# Altium schematic sheet EPS_MPPT_Y.SchDoc: MPPT-Y
size A3; SheetNumber: 17; SheetTotal: 51
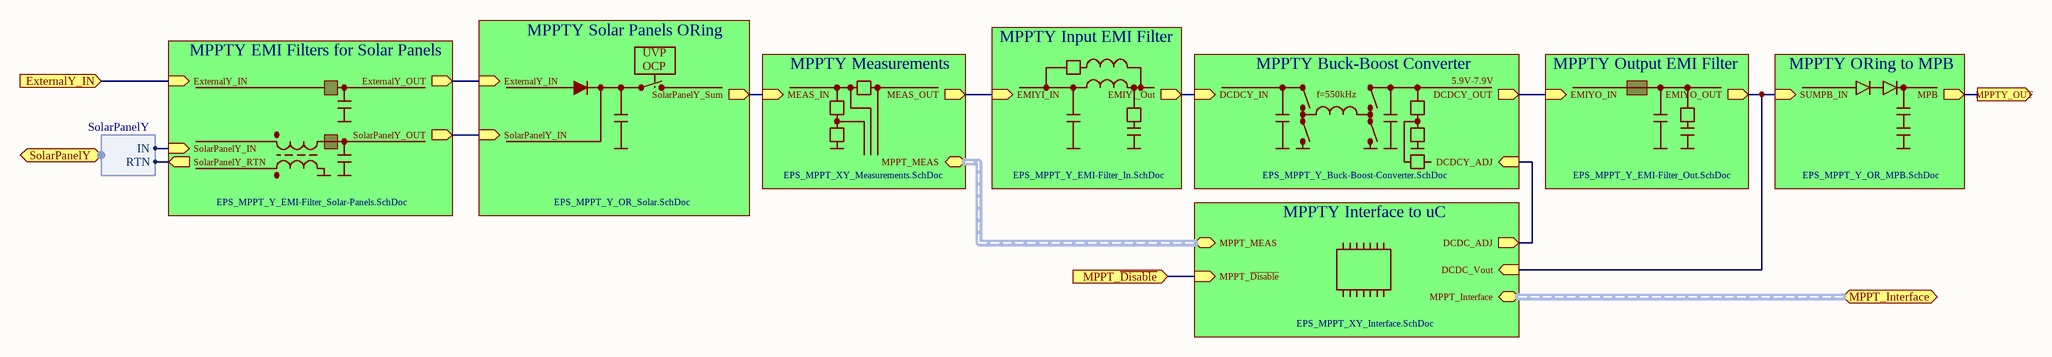
[diagram p0: EPS_MPPT_Y.SchDoc]

## Sub-sheets
MPPTY Buck-Boost Converter = EPS_MPPT_Y_Buck-Boost-Converter.SchDoc: DCDCY_IN (in), DCDCY_OUT (out), DCDCY_ADJ (in)
MPPTY EMI Filters for Solar Panels = EPS_MPPT_Y_EMI-Filter_Solar-Panels.SchDoc: SolarPanelY_IN (in), ExternalY_IN (in), SolarPanelY_RTN (out), ExternalY_OUT (out), SolarPanelY_OUT (out)
MPPTY Input EMI Filter = EPS_MPPT_Y_EMI-Filter_In.SchDoc: EMIYI_Out (out), EMIYI_IN (in)
MPPTY Interface to uC = EPS_MPPT_XY_Interface.SchDoc: DCDC_ADJ (out), MPPT_Interface (harness MPPT_Interface), MPPT_MEAS (harness MPPT_MEAS), DCDC_Vout (in), MPPT_~{Disable} (in)
MPPTY Measurements = EPS_MPPT_XY_Measurements.SchDoc: MEAS_IN (in), MEAS_OUT (out), MPPT_MEAS (harness MPPT_MEAS)
MPPTY ORing to MPB = EPS_MPPT_Y_OR_MPB.SchDoc: SUMPB_IN (in), MPB (out)
MPPTY Output EMI Filter = EPS_MPPT_Y_EMI-Filter_Out.SchDoc: EMIYO_IN (in), EMIYO_OUT (out)
MPPTY Solar Panels ORing = EPS_MPPT_Y_OR_Solar.SchDoc: ExternalY_IN (in), SolarPanelY_IN (in), SolarPanelY_Sum (out)

## Ports
ExternalY_IN (in), MPPT_Interface (harness MPPT_Interface), MPPT_~{Disable} (in), MPPTY_OUT (out), SolarPanelY (harness SolarPanelY)

## Harnesses
SolarPanelY: IN, RTN

## Nets
ExternalY_IN: port ExternalY_IN, sheet MPPTY EMI Filters for Solar Panels/ExternalY_IN
MPPT_~{Disable}: port MPPT_~{Disable}, sheet MPPTY Interface to uC/MPPT_~{Disable}
MPPTY_OUT: port MPPTY_OUT, sheet MPPTY ORing to MPB/MPB
(unnamed): sheet MPPTY Buck-Boost Converter/DCDCY_IN, sheet MPPTY Input EMI Filter/EMIYI_Out
(unnamed): sheet MPPTY Buck-Boost Converter/DCDCY_OUT, sheet MPPTY Output EMI Filter/EMIYO_IN
(unnamed): sheet MPPTY Buck-Boost Converter/DCDCY_ADJ, sheet MPPTY Interface to uC/DCDC_ADJ
(unnamed): sheet MPPTY Solar Panels ORing/ExternalY_IN, sheet MPPTY EMI Filters for Solar Panels/ExternalY_OUT
(unnamed): sheet MPPTY Solar Panels ORing/SolarPanelY_IN, sheet MPPTY EMI Filters for Solar Panels/SolarPanelY_OUT
(unnamed): sheet MPPTY Solar Panels ORing/SolarPanelY_Sum, sheet MPPTY Measurements/MEAS_IN
(unnamed): sheet MPPTY EMI Filters for Solar Panels/SolarPanelY_IN, port SolarPanelY.IN
(unnamed): sheet MPPTY EMI Filters for Solar Panels/SolarPanelY_RTN, port SolarPanelY.RTN
(unnamed): sheet MPPTY Interface to uC/DCDC_Vout, sheet MPPTY Output EMI Filter/EMIYO_OUT, sheet MPPTY ORing to MPB/SUMPB_IN
(unnamed): sheet MPPTY Measurements/MEAS_OUT, sheet MPPTY Input EMI Filter/EMIYI_IN

## Buses and harness runs
harness port MPPT_Interface = sheet MPPTY Interface to uC/MPPT_Interface
harness sheet MPPTY Interface to uC/MPPT_MEAS = sheet MPPTY Measurements/MPPT_MEAS

## Notes on the sheet
- UVP
- OCP
- f=550kHz
- 5.9V-7.9V
- Title:
- Project:
- Author:
- Model:
- Document Number:
- Checked by:
- Rev:
- Date:
- Approved by:
- Sheet:
- of
- File name: